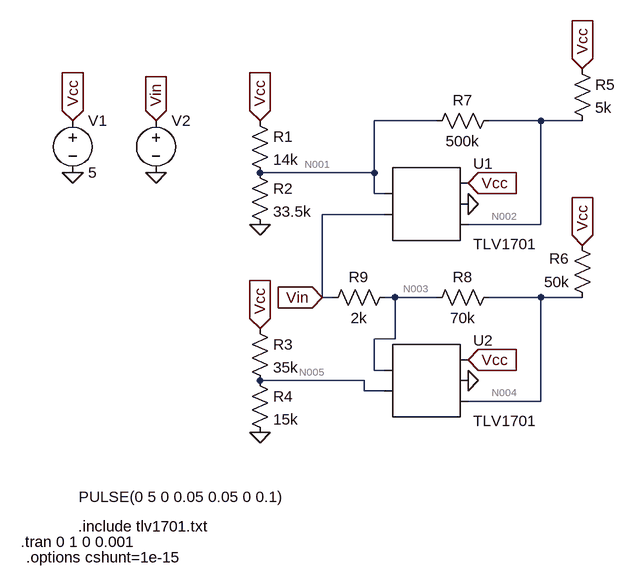
[diagram p0: schematic Window Comparator.asc]
* Window Comparator.asc
R1 Vcc N001 14k
R2 N001 0 33.5k
R3 Vcc N005 35k
R4 N005 0 15k
R5 Vcc N002 5k
R6 N004 Vcc 50k
R7 N002 N001 500k
R8 N004 N003 70k
R9 N003 Vin 2k
V1 Vcc 0 5
V2 Vin 0 PULSE(0 5 0 0.05 0.05 0 0.1)
* U1: TLV1701 (symbol AutoGenerated\TLV1701 not available, pins judged from their places): pin1=N001 pin2=Vin pin3=Vcc pin4=0 pin5=N002
* U2: TLV1701 (symbol AutoGenerated\TLV1701 not available, pins judged from their places): pin1=N003 pin2=N005 pin3=Vcc pin4=0 pin5=N004
.include tlv1701.txt
.tran 0 1 0 0.001
.options cshunt=1e-15
.backanno
.end

* Results of the author's LTspice run, read from the files saved beside the schematic
* Operating Point, zero values left out:
*   V(vcc) = 5 V
*   V(n001) = 3.555 V
*   V(n005) = 1.5 V
*   V(n002) = 4.985 V
*   V(n004) = 2.947 V
*   V(n003) = 81.86 mV
*   I(R9) = 40.93 µA
*   I(R8) = 40.94 µA
*   I(R7) = 2.862 µA
*   I(R6) = -41.05 µA
*   I(R5) = 2.932 µA
*   I(R4) = 100 µA
*   I(R3) = 100 µA
*   I(R2) = 106.1 µA
*   I(R1) = 103.2 µA
*   I(V2) = 40.93 µA
*   I(V1) = -357.4 µA
*   Ix(u1:INP) = 5.002 nA
*   Ix(u1:INN) = 4.495 nA
*   Ix(u1:VCC) = 55.08 µA
*   Ix(u1:VEE) = -55.08 µA
*   Ix(u1:OUT) = 70.25 nA
*   Ix(u2:INP) = 4.995 nA
*   Ix(u2:INN) = 4.498 nA
*   Ix(u2:VCC) = 55.12 µA
*   Ix(u2:VEE) = -55.12 µA
*   Ix(u2:OUT) = 117.9 nA
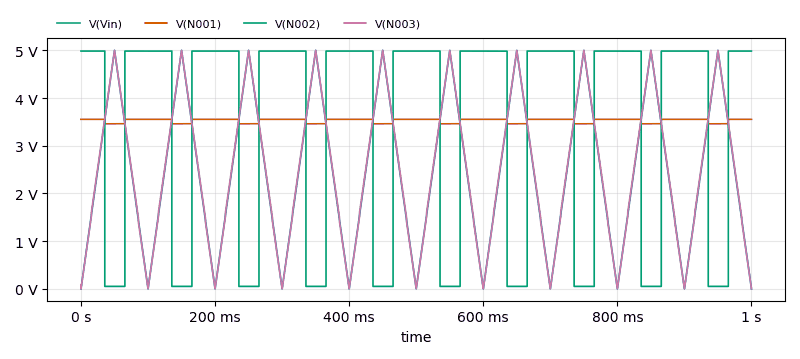
[diagram p1: Transient Analysis of Window Comparator.asc, plotted from the saved traces]
* Transient Analysis, 1 run:
*   V(Vin): min 0 V, max 5 V, average 2.5 V, rms 2.964 V, last 0 V
*   V(N001): min 3.459 V, max 3.555 V, average 3.526 V, rms 3.526 V, last 3.555 V
*   V(N002): min 49.84 mV, max 4.985 V, average 3.507 V, rms 4.173 V, last 4.985 V
*   V(N003): min 129.5 µV, max 5 V, average 2.514 V, rms 2.977 V, last 129.9 µV